# Altium project test1.PrjPcb
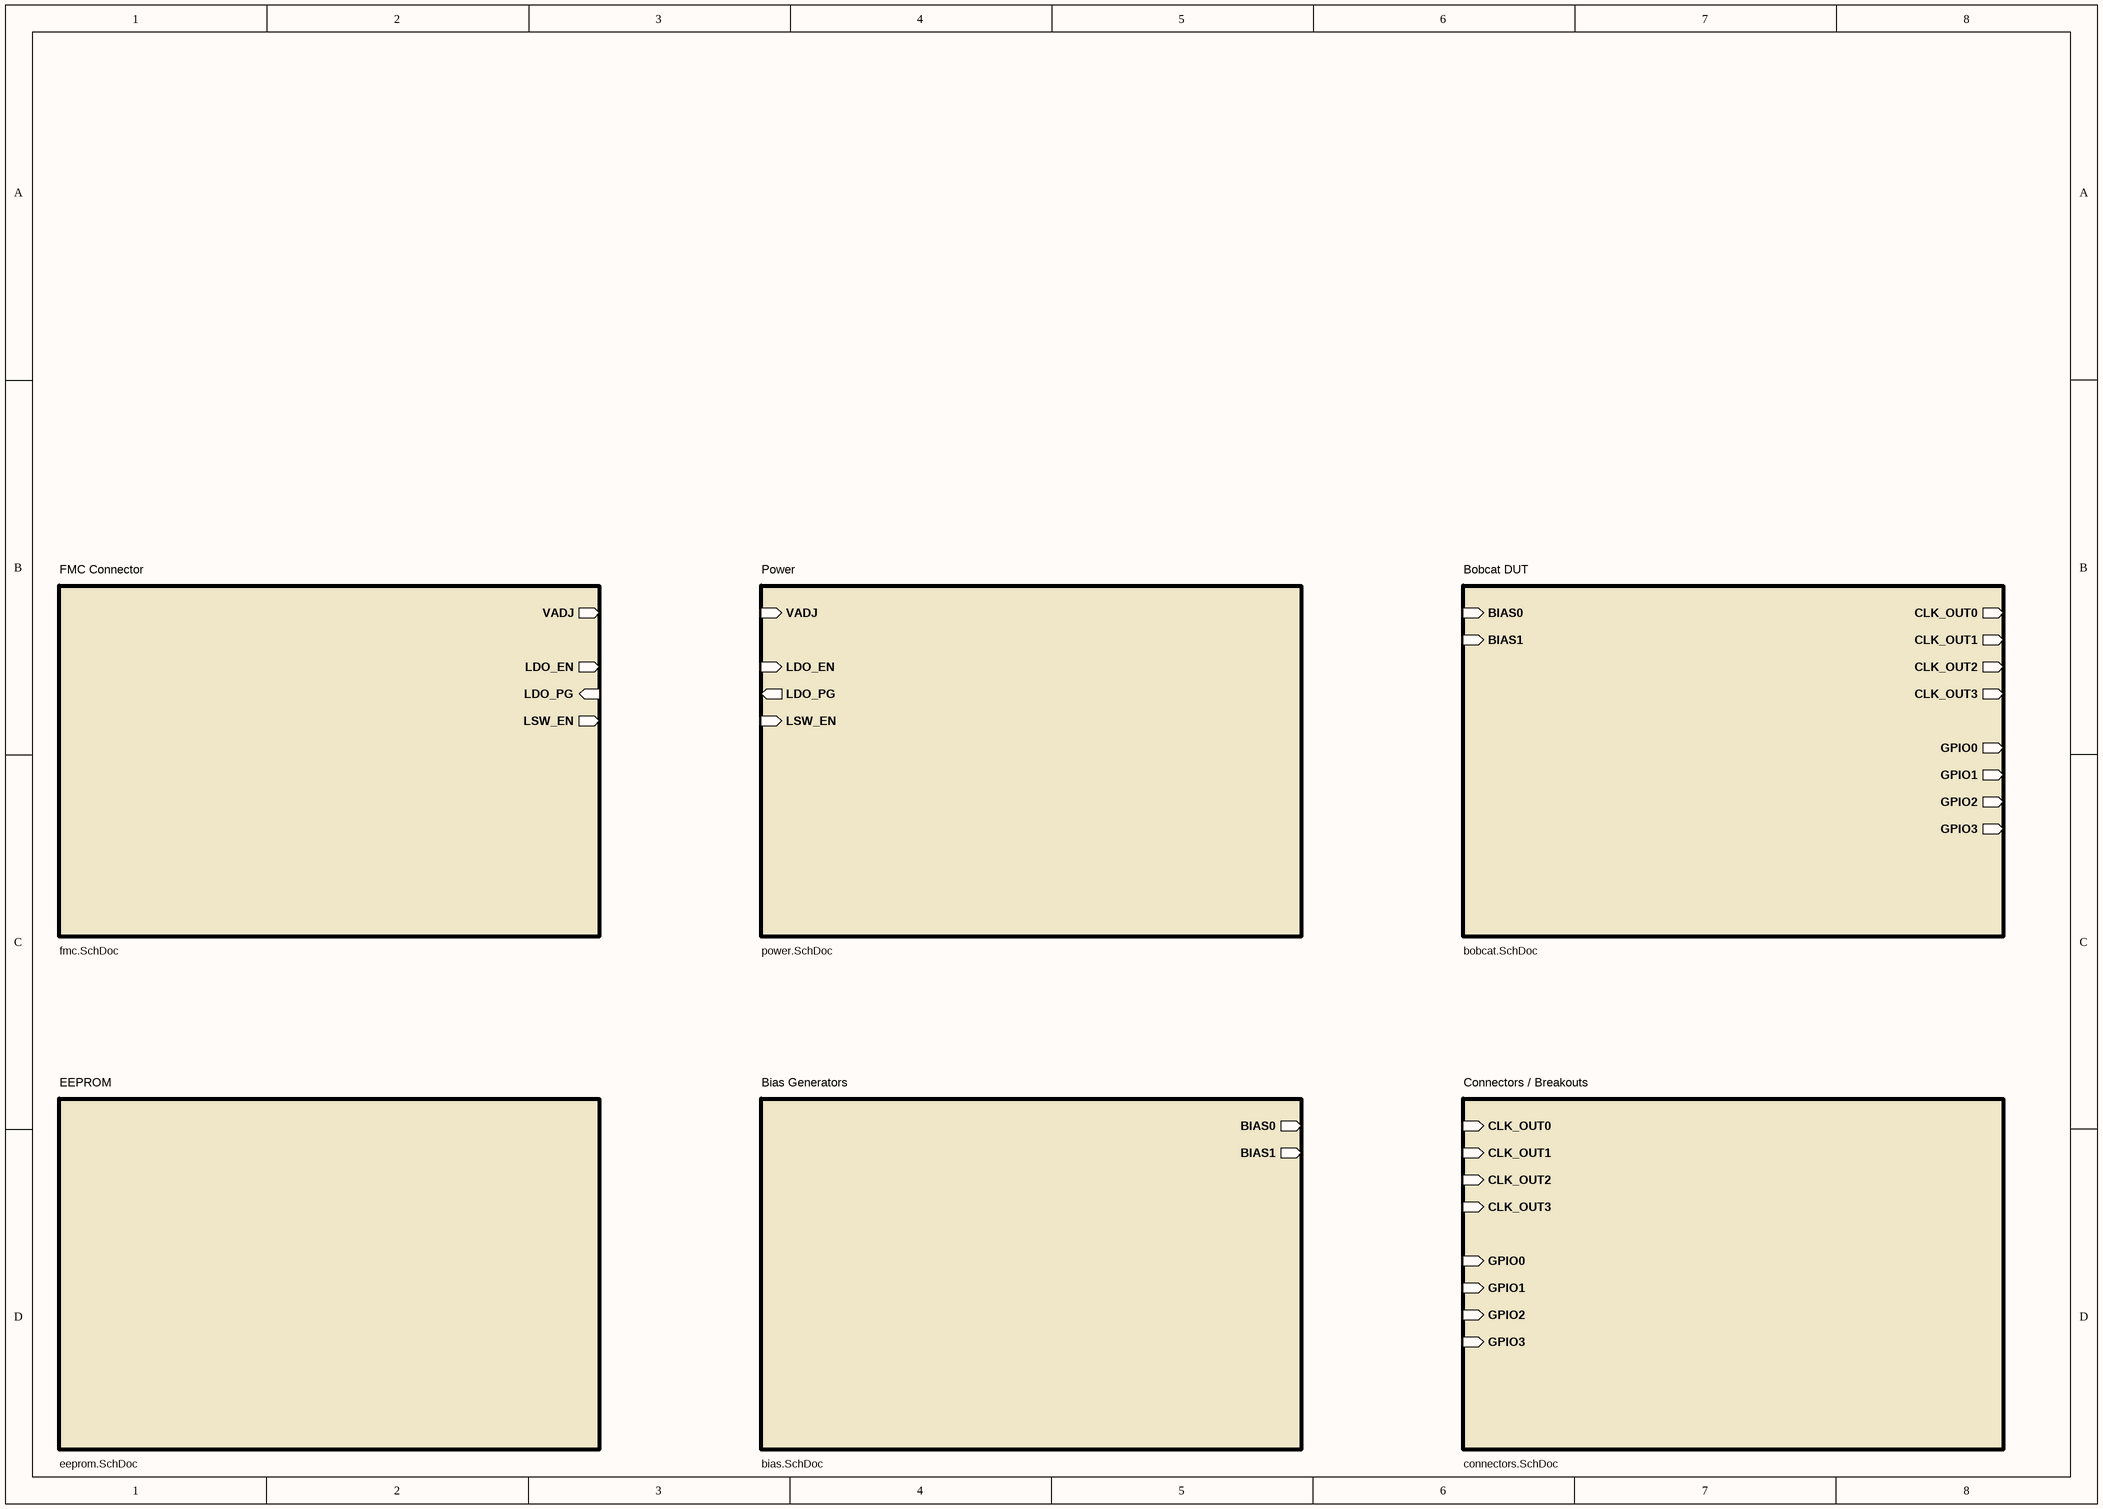
[diagram p0: root.SchDoc]
7 sheets, 107 parts. Net scope: hierarchical (ports join the sheet entries above them; power ports are global).
Sheets:
  root.SchDoc
    FMC Connector = fmc.SchDoc
    Power = power.SchDoc
    Bobcat DUT = bobcat.SchDoc
    EEPROM = eeprom.SchDoc
    Bias Generators = bias.SchDoc
    Connectors / Breakouts = connectors.SchDoc

## Sheet root.SchDoc
size A3

### Sub-sheets
Bias Generators = bias.SchDoc: BIAS0 (out), BIAS1 (out)
Bobcat DUT = bobcat.SchDoc: BIAS0 (in), BIAS1 (in), CLK_OUT0 (out), CLK_OUT1 (out), CLK_OUT2 (out), CLK_OUT3 (out), GPIO0 (out), GPIO1 (out), GPIO2 (out), GPIO3 (out)
Connectors / Breakouts = connectors.SchDoc: CLK_OUT0 (in), CLK_OUT1 (in), CLK_OUT2 (in), CLK_OUT3 (in), GPIO0 (in), GPIO1 (in), GPIO2 (in), GPIO3 (in)
EEPROM = eeprom.SchDoc: no entries
FMC Connector = fmc.SchDoc: VADJ (out), LDO_EN (out), LDO_PG (in), LSW_EN (out)
Power = power.SchDoc: VADJ (in), LDO_EN (in), LDO_PG (out), LSW_EN (in)

## Sheet fmc.SchDoc
size A3
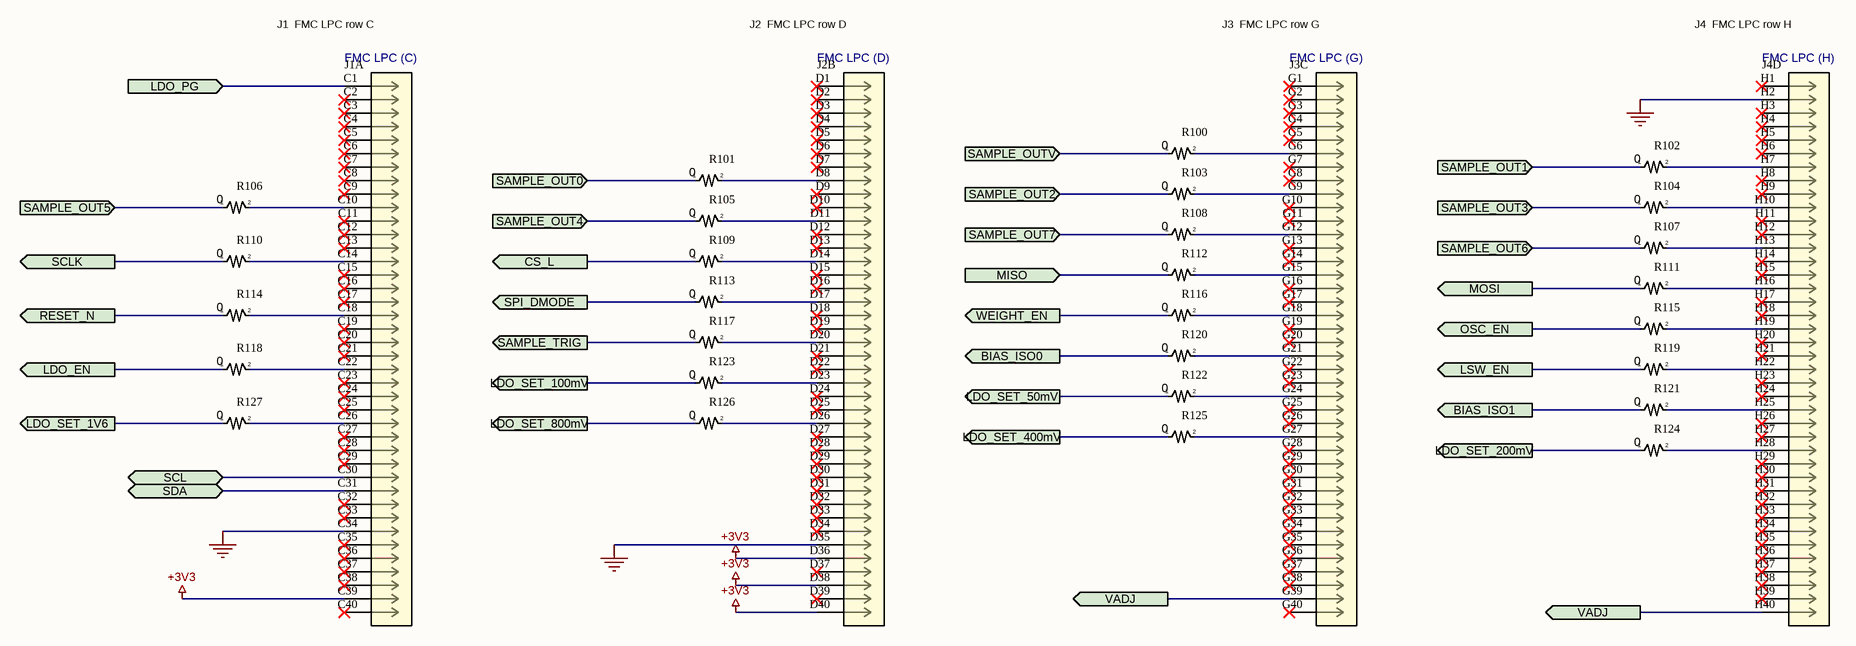
[diagram p1: fmc.SchDoc]

### Parts
J1  FMC LPC (C)  (part A of 3)
J2  FMC LPC (D)  (part B of 3)
J3  FMC LPC (G)  (part C of 3)
J4  FMC LPC (H)  (part D of 3)
R100  0
R101  0
R102  0
R103  0
R104  0
R105  0
R106  0
R107  0
R108  0
R109  0
R110  0
R111  0
R112  0
R113  0
R114  0
R115  0
R116  0
R117  0
R118  0
R119  0
R120  0
R121  0
R122  0
R123  0
R124  0
R125  0
R126  0
R127  0

### Ports
BIAS_ISO0 (out), BIAS_ISO1 (out), CS_L (out), LDO_EN (out), LDO_PG (in), LDO_SET_1V6 (out), LDO_SET_50mV (out), LDO_SET_100mV (out), LDO_SET_200mV (out), LDO_SET_400mV (out), LDO_SET_800mV (out), LSW_EN (out), MISO (in), MOSI (out), OSC_EN (out), RESET_N (out), SAMPLE_OUT0 (in), SAMPLE_OUT1 (in), SAMPLE_OUT2 (in), SAMPLE_OUT3 (in), SAMPLE_OUT4 (in), SAMPLE_OUT5 (in), SAMPLE_OUT6 (in), SAMPLE_OUT7 (in), SAMPLE_OUTV (in), SAMPLE_TRIG (out), SCL (bidir), SCLK (out), SDA (bidir), SPI_DMODE (out), VADJ (out), WEIGHT_EN (out)

### Nets
+3V3: J1.C39 J2.D36 J2.D38 J2.D40
GND: J1.C34 J2.D35 J4.H2
NetJ1_C1: J1.C1 ; port LDO_PG
NetJ1_C10: J1.C10 R106.2
NetJ1_C14: J1.C14 R110.2
NetJ1_C18: J1.C18 R114.2
NetJ1_C22: J1.C22 R118.2
NetJ1_C26: J1.C26 R127.2
NetJ1_C30: J1.C30 ; port SCL
NetJ1_C31: J1.C31 ; port SDA
NetJ2_D8: J2.D8 R101.2
NetJ2_D11: J2.D11 R105.2
NetJ2_D14: J2.D14 R109.2
NetJ2_D17: J2.D17 R113.2
NetJ2_D20: J2.D20 R117.2
NetJ2_D23: J2.D23 R123.2
NetJ2_D26: J2.D26 R126.2
NetJ3_G6: J3.G6 R100.2
NetJ3_G9: J3.G9 R103.2
NetJ3_G12: J3.G12 R108.2
NetJ3_G15: J3.G15 R112.2
NetJ3_G18: J3.G18 R116.2
NetJ3_G21: J3.G21 R120.2
NetJ3_G24: J3.G24 R122.2
NetJ3_G27: J3.G27 R125.2
NetJ3_G39: J3.G39 J4.H40 ; port VADJ
NetJ4_H7: J4.H7 R102.2
NetJ4_H10: J4.H10 R104.2
NetJ4_H13: J4.H13 R107.2
NetJ4_H16: J4.H16 R111.2
NetJ4_H19: J4.H19 R115.2
NetJ4_H22: J4.H22 R119.2
NetJ4_H25: J4.H25 R121.2
NetJ4_H28: J4.H28 R124.2
NetR100_1: R100.1 ; port SAMPLE_OUTV
NetR101_1: R101.1 ; port SAMPLE_OUT0
NetR102_1: R102.1 ; port SAMPLE_OUT1
NetR103_1: R103.1 ; port SAMPLE_OUT2
NetR104_1: R104.1 ; port SAMPLE_OUT3
NetR105_1: R105.1 ; port SAMPLE_OUT4
NetR106_1: R106.1 ; port SAMPLE_OUT5
NetR107_1: R107.1 ; port SAMPLE_OUT6
NetR108_1: R108.1 ; port SAMPLE_OUT7
NetR109_1: R109.1 ; port CS_L
NetR110_1: R110.1 ; port SCLK
NetR111_1: R111.1 ; port MOSI
NetR112_1: R112.1 ; port MISO
NetR113_1: R113.1 ; port SPI_DMODE
NetR114_1: R114.1 ; port RESET_N
NetR115_1: R115.1 ; port OSC_EN
NetR116_1: R116.1 ; port WEIGHT_EN
NetR117_1: R117.1 ; port SAMPLE_TRIG
NetR118_1: R118.1 ; port LDO_EN
NetR119_1: R119.1 ; port LSW_EN
NetR120_1: R120.1 ; port BIAS_ISO0
NetR121_1: R121.1 ; port BIAS_ISO1
NetR122_1: R122.1 ; port LDO_SET_50mV
NetR123_1: R123.1 ; port LDO_SET_100mV
NetR124_1: R124.1 ; port LDO_SET_200mV
NetR125_1: R125.1 ; port LDO_SET_400mV
NetR126_1: R126.1 ; port LDO_SET_800mV
NetR127_1: R127.1 ; port LDO_SET_1V6

Not connected (* = marked no-connect by the designer): J1 C2* C3* C4* C5* C6* C7* C8* C9* C11* C12* C13* C15* C16* C17* C19* C20* C21* C23* C24* C25* C27* C28* C29* C32* C33* C35* C36* C37* C38* C40*; J2 D1* D2* D3* D4* D5* D6* D7* D9* D10* D12* D13* D15* D16* D18* D19* D21* D22* D24* D25* D27* D28* D29* D30* D31* D32* D33* D34* D37* D39*; J3 G1* G2* G3* G4* G5* G7* G8* G10* G11* G13* G14* G16* G17* G19* G20* G22* G23* G25* G26* G28* G29* G30* G31* G32* G33* G34* G35* G36* G37* G38* G40*; J4 H1* H3* H4* H5* H6* H8* H9* H11* H12* H14* H15* H17* H18* H20* H21* H23* H24* H26* H27* H29* H30* H31* H32* H33* H34* H35* H36* H37* H38* H39*

### Notes on the sheet
- J1  FMC LPC row C
- J2  FMC LPC row D
- J3  FMC LPC row G
- J4  FMC LPC row H

### Library data of the parts
J1-J4 = ASP-134606-01: Description; Manufacturer_Name: Samtec Inc; Type: Arrays, Edge Type, Mezzanine (Board to Board); Copyright: Copyright (C) 2025 Ultra Librarian. All rights reserved.; Manufacturer_Part_Number: ASP-134606-01; RefDes: RefDes
R100-R127 = CRCW04020000Z0ED: D10/CRCW0402 0R0 ET7 e3; Manufacturer_Name: Vishay; Manufacturer_Part_Number: CRCW04020000Z0ED

## Sheet power.SchDoc
size A3
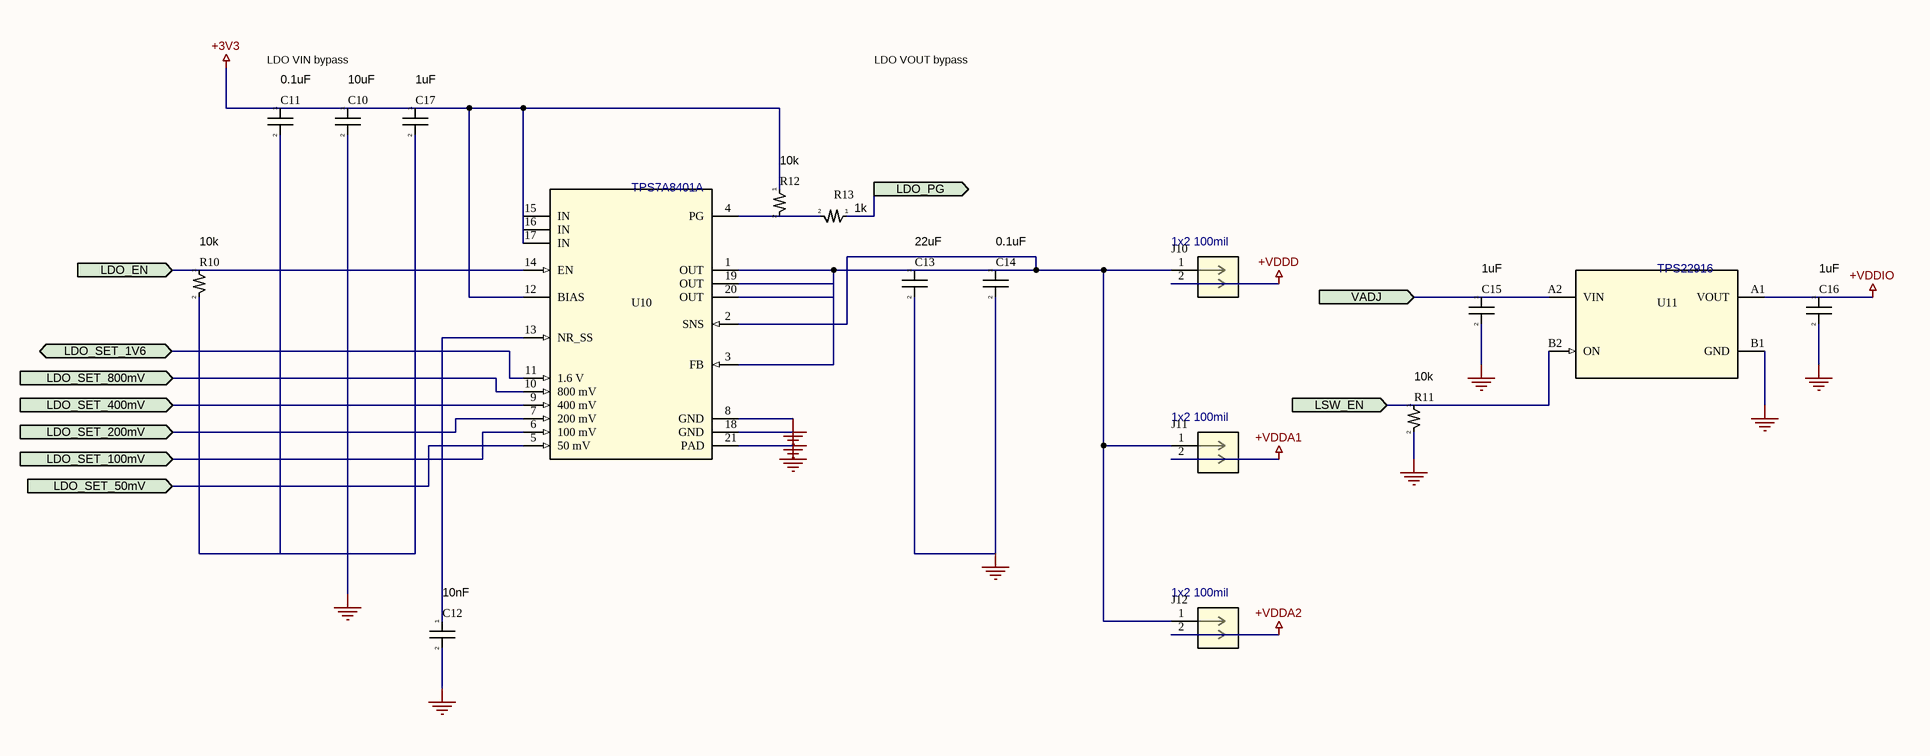
[diagram p2: power.SchDoc]

### Parts
C10  10uF
C11  0.1uF
C12  10nF
C13  22uF
C14  0.1uF
C15  1uF
C16  1uF
C17  1uF
J10  1x2 100mil
J11  1x2 100mil
J12  1x2 100mil
R10  10k
R11  10k
R12  10k
R13  1k
U10  TPS7A8401A
U11  TPS22916

### Ports
LDO_EN (in), LDO_PG (out), LDO_SET_1V6 (in), LDO_SET_50mV (in), LDO_SET_100mV (in), LDO_SET_200mV (in), LDO_SET_400mV (in), LDO_SET_800mV (in), LSW_EN (in), VADJ (in)

### Nets
+3V3: C10.1 C11.1 C17.1 R12.1 U10.12(BIAS) U10.15(IN) U10.16(IN) U10.17(IN)
+VDDA1: J11.2
+VDDA2: J12.2
+VDDD: J10.2
+VDDIO: C16.1 U11.A1(VOUT)
GND: C10.2 C11.2 C12.2 C13.2 C14.2 C15.2 C16.2 C17.2 R10.2 R11.2 U10.8(GND) U10.18(GND) U10.21(PAD) U11.B1(GND)
NetC12_1: C12.1 U10.13(NR_SS)
NetC13_1: C13.1 C14.1 J10.1 J11.1 J12.1 U10.1(OUT) U10.2(SNS) U10.3(FB) U10.19(OUT) U10.20(OUT)
NetC15_1: C15.1 U11.A2(VIN) ; port VADJ
NetR10_1: R10.1 U10.14(EN) ; port LDO_EN
NetR11_1: R11.1 U11.B2(ON) ; port LSW_EN
NetR12_2: R12.2 R13.2 U10.4(PG)
NetR13_1: R13.1 ; port LDO_PG
NetU10_5: U10.5(50_mV) ; port LDO_SET_50mV
NetU10_6: U10.6(100_mV) ; port LDO_SET_100mV
NetU10_7: U10.7(200_mV) ; port LDO_SET_200mV
NetU10_9: U10.9(400_mV) ; port LDO_SET_400mV
NetU10_10: U10.10(800_mV) ; port LDO_SET_800mV
NetU10_11: U10.11(1.6_V) ; port LDO_SET_1V6

### Notes on the sheet
- LDO VIN bypass
- LDO VOUT bypass

### Library data of the parts
C10 = GRM21BR71A106KA73L: Manufacturer_Name: Murata; Manufacturer_Part_Number: GRM21BR71A106KA73L
C11 C14 = GRM155R71C104KA88D: CAP CER 0.1UF 16V X7R 0402; Manufacturer_Name: Murata; Manufacturer_Part_Number: GRM155R71C104KA88D
C12 = GRM155R71H103KA88D: Manufacturer_Name: Murata; Manufacturer_Part_Number: GRM155R71H103KA88D
C13 = GRM21BR61A226ME44L: Manufacturer_Name: Murata; Manufacturer_Part_Number: GRM21BR61A226ME44L
C15-C17 = GRM155R70J105KA12D: Manufacturer_Name: Murata; Manufacturer_Part_Number: GRM155R70J105KA12D
J10-J12 = TSW-102-05-G-S: No Description Available; Manufacturer_Name: Samtec Inc; Copyright: Copyright (C) 2026 Ultra Librarian. All rights reserved.; Manufacturer_Part_Number: TSW-102-05-G-S; RefDes: RefDes; Type: Type
R10-R12 = CR0402-FX-1002GLF: Manufacturer_Name: Bourns Electronics; Manufacturer_Part_Number: CR0402-FX-1002GLF
R13 = CR0402-FX-1001GLF: Manufacturer_Name: Bourns Electronics; Manufacturer_Part_Number: CR0402-FX-1001GLF
U10 = TPS7A8401ARGRR: 3-A, low-VIN (1.1-V), low-noise, high-accuracy, ultra-low-dropout voltage regulator with power good 20-VQFN -40 to 125; Manufacturer_Name: Texas Instruments; TYPE: TYPE; RefDes: RefDes; Copyright: Copyright (C) 2025 Ultra Librarian. All rights reserved.; Manufacturer_Part_Number: TPS7A8401ARGRR
U11 = TPS22916CNYFPR: 5.5-V, 2-A, 60-mΩ, 10-nA leakage load switch with output discharge 4-DSBGA -40 to 85; Manufacturer_Name: Texas Instruments; Description: 5.5-V, 2-A, 60-mÎ©, 10-nA leakage load switch with output discharge 4-DSBGA -40 to 85; TYPE: TYPE; RefDes: RefDes; Copyright: Copyright (C) 2026 Ultra Librarian. All rights reserved.; Manufacturer_Part_Number: TPS22916CNYFPR

## Sheet bobcat.SchDoc
size A2
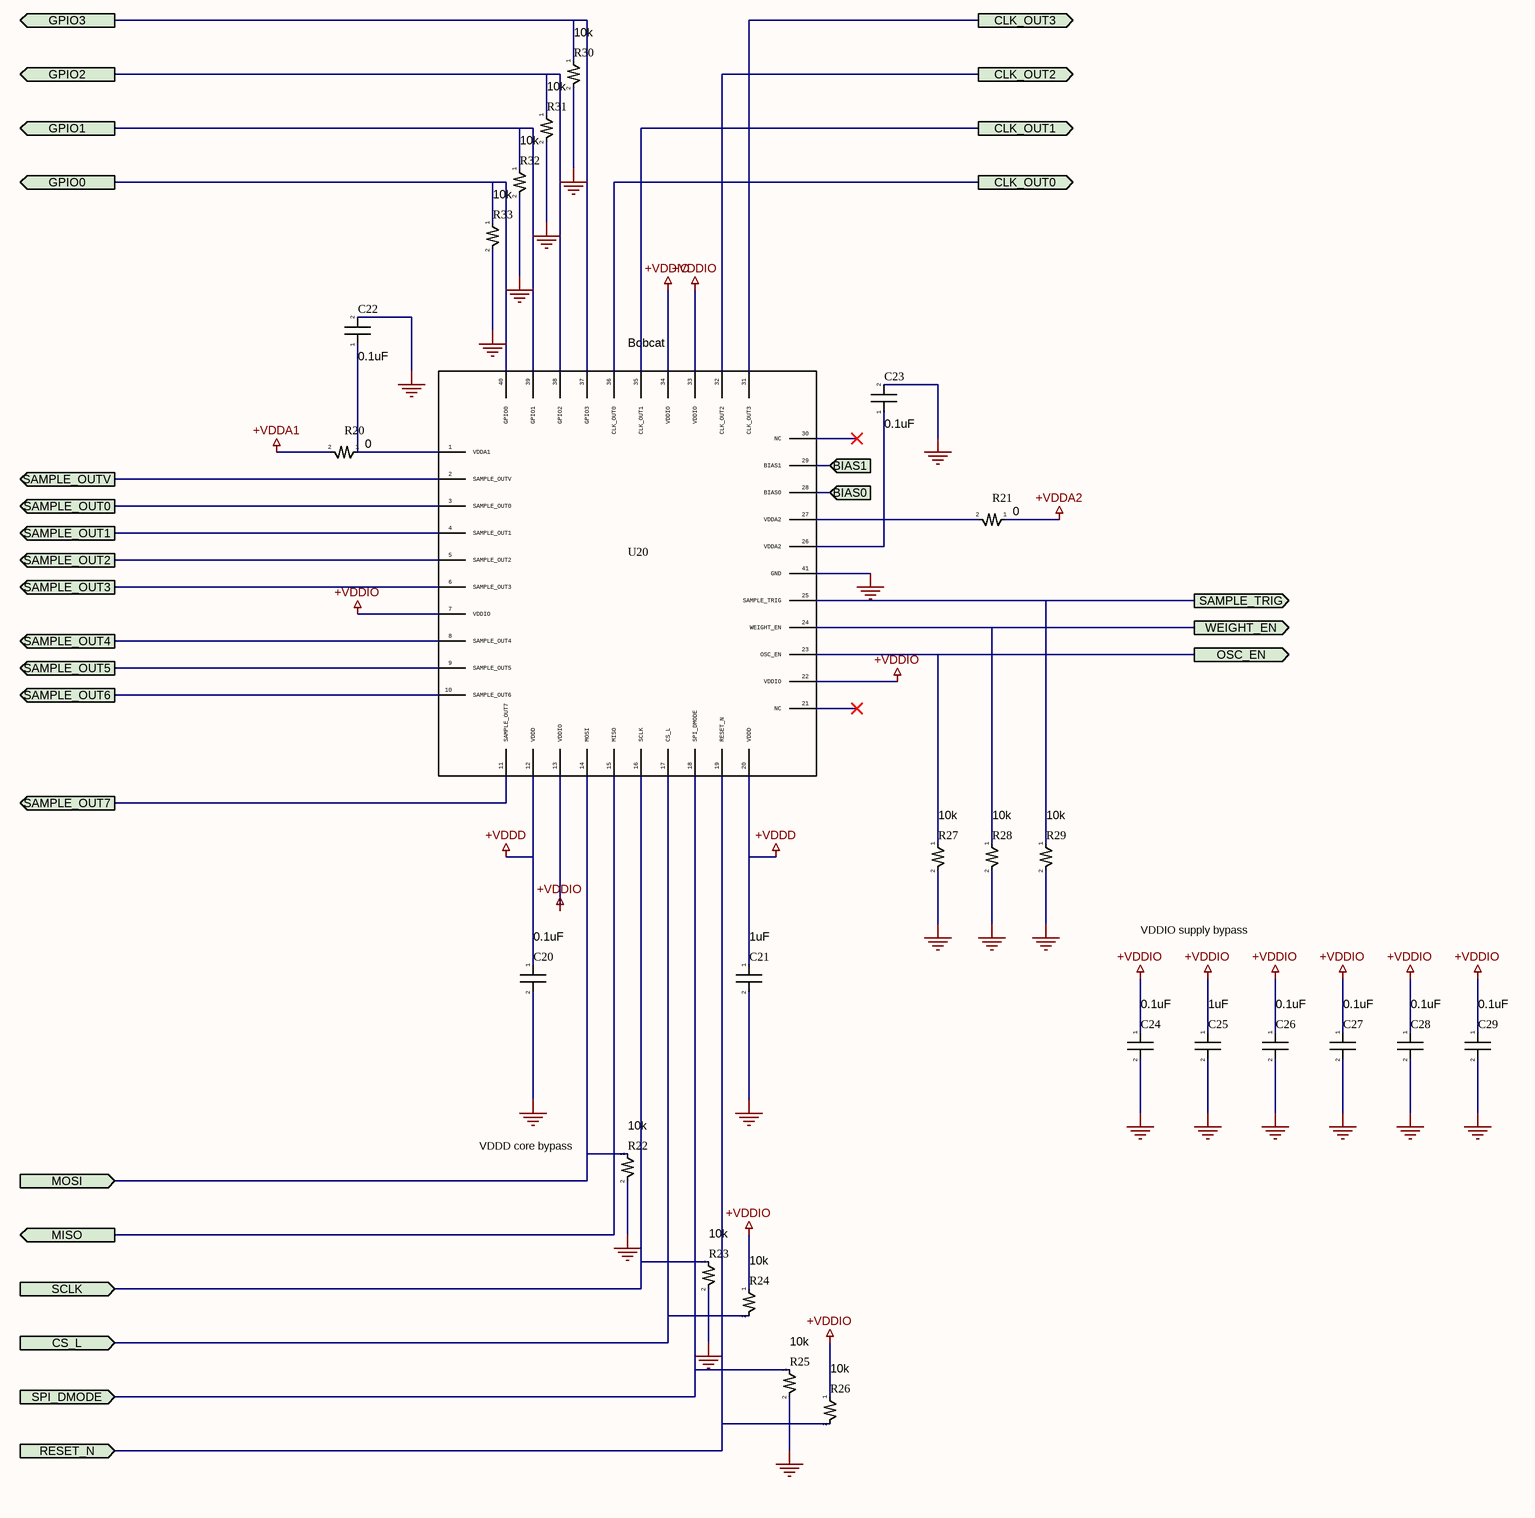
[diagram p3: bobcat.SchDoc]

### Parts
C20  0.1uF
C21  1uF
C22  0.1uF
C23  0.1uF
C24  0.1uF
C25  1uF
C26  0.1uF
C27  0.1uF
C28  0.1uF
C29  0.1uF
R20  0
R21  0
R22  10k
R23  10k
R24  10k
R25  10k
R26  10k
R27  10k
R28  10k
R29  10k
R30  10k
R31  10k
R32  10k
R33  10k
U20  Bobcat

### Ports
BIAS0 (in), BIAS1 (in), CLK_OUT0 (out), CLK_OUT1 (out), CLK_OUT2 (out), CLK_OUT3 (out), CS_L (in), GPIO0 (out), GPIO1 (out), GPIO2 (out), GPIO3 (out), MISO (out), MOSI (in), OSC_EN (out), RESET_N (in), SAMPLE_OUT0 (out), SAMPLE_OUT1 (out), SAMPLE_OUT2 (out), SAMPLE_OUT3 (out), SAMPLE_OUT4 (out), SAMPLE_OUT5 (out), SAMPLE_OUT6 (out), SAMPLE_OUT7 (out), SAMPLE_OUTV (out), SAMPLE_TRIG (out), SCLK (in), SPI_DMODE (in), WEIGHT_EN (out)

### Nets
+VDDA1: R20.2
+VDDA2: R21.1
+VDDD: C20.1 C21.1 U20.12(VDDD) U20.20(VDDD)
+VDDIO: C24.1 C25.1 C26.1 C27.1 C28.1 C29.1 R24.1 R26.1 U20.7(VDDIO) U20.13(VDDIO) U20.22(VDDIO) U20.33(VDDIO) U20.34(VDDIO)
GND: C20.2 C21.2 C22.2 C23.2 C24.2 C25.2 C26.2 C27.2 C28.2 C29.2 R22.2 R23.2 R25.2 R27.2 R28.2 R29.2 R30.2 R31.2 R32.2 R33.2 U20.41(GND)
NetC22_1: C22.1 R20.1 U20.1(VDDA1)
NetC23_1: C23.1 R21.2 U20.26(VDDA2) U20.27(VDDA2)
NetR22_1: R22.1 U20.14(MOSI) ; port MOSI
NetR23_1: R23.1 U20.16(SCLK) ; port SCLK
NetR24_2: R24.2 U20.17(CS_L) ; port CS_L
NetR25_1: R25.1 U20.18(SPI_DMODE) ; port SPI_DMODE
NetR26_2: R26.2 U20.19(RESET_N) ; port RESET_N
NetR27_1: R27.1 U20.23(OSC_EN) ; port OSC_EN
NetR28_1: R28.1 U20.24(WEIGHT_EN) ; port WEIGHT_EN
NetR29_1: R29.1 U20.25(SAMPLE_TRIG) ; port SAMPLE_TRIG
NetR30_1: R30.1 U20.37(GPIO3) ; port GPIO3
NetR31_1: R31.1 U20.38(GPIO2) ; port GPIO2
NetR32_1: R32.1 U20.39(GPIO1) ; port GPIO1
NetR33_1: R33.1 U20.40(GPIO0) ; port GPIO0
NetU20_2: U20.2(SAMPLE_OUTV) ; port SAMPLE_OUTV
NetU20_3: U20.3(SAMPLE_OUT0) ; port SAMPLE_OUT0
NetU20_4: U20.4(SAMPLE_OUT1) ; port SAMPLE_OUT1
NetU20_5: U20.5(SAMPLE_OUT2) ; port SAMPLE_OUT2
NetU20_6: U20.6(SAMPLE_OUT3) ; port SAMPLE_OUT3
NetU20_8: U20.8(SAMPLE_OUT4) ; port SAMPLE_OUT4
NetU20_9: U20.9(SAMPLE_OUT5) ; port SAMPLE_OUT5
NetU20_10: U20.10(SAMPLE_OUT6) ; port SAMPLE_OUT6
NetU20_11: U20.11(SAMPLE_OUT7) ; port SAMPLE_OUT7
NetU20_15: U20.15(MISO) ; port MISO
NetU20_28: U20.28(BIAS0) ; port BIAS0
NetU20_29: U20.29(BIAS1) ; port BIAS1
NetU20_31: U20.31(CLK_OUT3) ; port CLK_OUT3
NetU20_32: U20.32(CLK_OUT2) ; port CLK_OUT2
NetU20_35: U20.35(CLK_OUT1) ; port CLK_OUT1
NetU20_36: U20.36(CLK_OUT0) ; port CLK_OUT0

Not connected (* = marked no-connect by the designer): U20 21(NC)* 30(NC)*

### Notes on the sheet
- VDDIO supply bypass
- VDDD core bypass

### Library data of the parts
C20 C22-C24 C26-C29 = GRM155R71C104KA88D: as C11 on sheet power; Manufacturer_Part_Number: GRM155R71C104KA88D
C21 C25 = GRM155R70J105KA12D: Manufacturer_Name: Murata; Manufacturer_Part_Number: GRM155R70J105KA12D
R20 R21 = CRCW04020000Z0ED: as R100 on sheet fmc; Manufacturer_Part_Number: CRCW04020000Z0ED
R22-R33 = CR0402-FX-1002GLF: Manufacturer_Name: Bourns Electronics; Manufacturer_Part_Number: CR0402-FX-1002GLF
U20 = Bobcat: Bobcat mixed-signal test chip — 40-QFN, 5x5 mm, 0.4 mm pitch, exposed GND pad (41); Manufacturer: Unconventional AI; Value: Bobcat; Footprint: Bobcat:QFN-40_5x5mm_P0.4mm_EP3.5mm; MPN: Bobcat

## Sheet eeprom.SchDoc
size A4
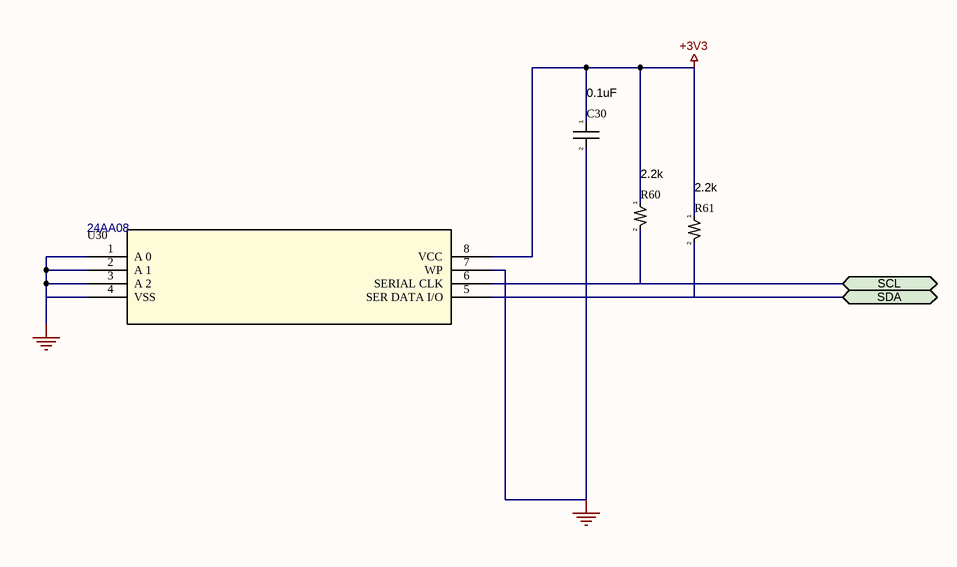
[diagram p4: eeprom.SchDoc]

### Parts
C30  0.1uF
R60  2.2k
R61  2.2k
U30  24AA08

### Ports
SCL (bidir), SDA (bidir)

### Nets
+3V3: C30.1 R60.1 R61.1 U30.8(VCC)
GND: C30.2 U30.1(A_0) U30.2(A_1) U30.3(A_2) U30.4(VSS) U30.7(WP)
NetR60_2: R60.2 U30.6(SERIAL_CLK) ; port SCL
NetR61_2: R61.2 U30.5(SER_DATA_I/O) ; port SDA

### Library data of the parts
C30 = GRM155R71C104KA88D: as C11 on sheet power; Manufacturer_Part_Number: GRM155R71C104KA88D
R60 R61 = CR0402-FX-2201GLF: Manufacturer_Name: Bourns Electronics; Manufacturer_Part_Number: CR0402-FX-2201GLF
U30 = 24AA08-ISN: No Description Available; Manufacturer_Name: Microchip; Manufacturer_Part_Number: 24AA08-I/SN; Copyright: Copyright (C) 2026 Ultra Librarian. All rights reserved.; RefDes: RefDes; Type: Type

## Sheet bias.SchDoc
size A2
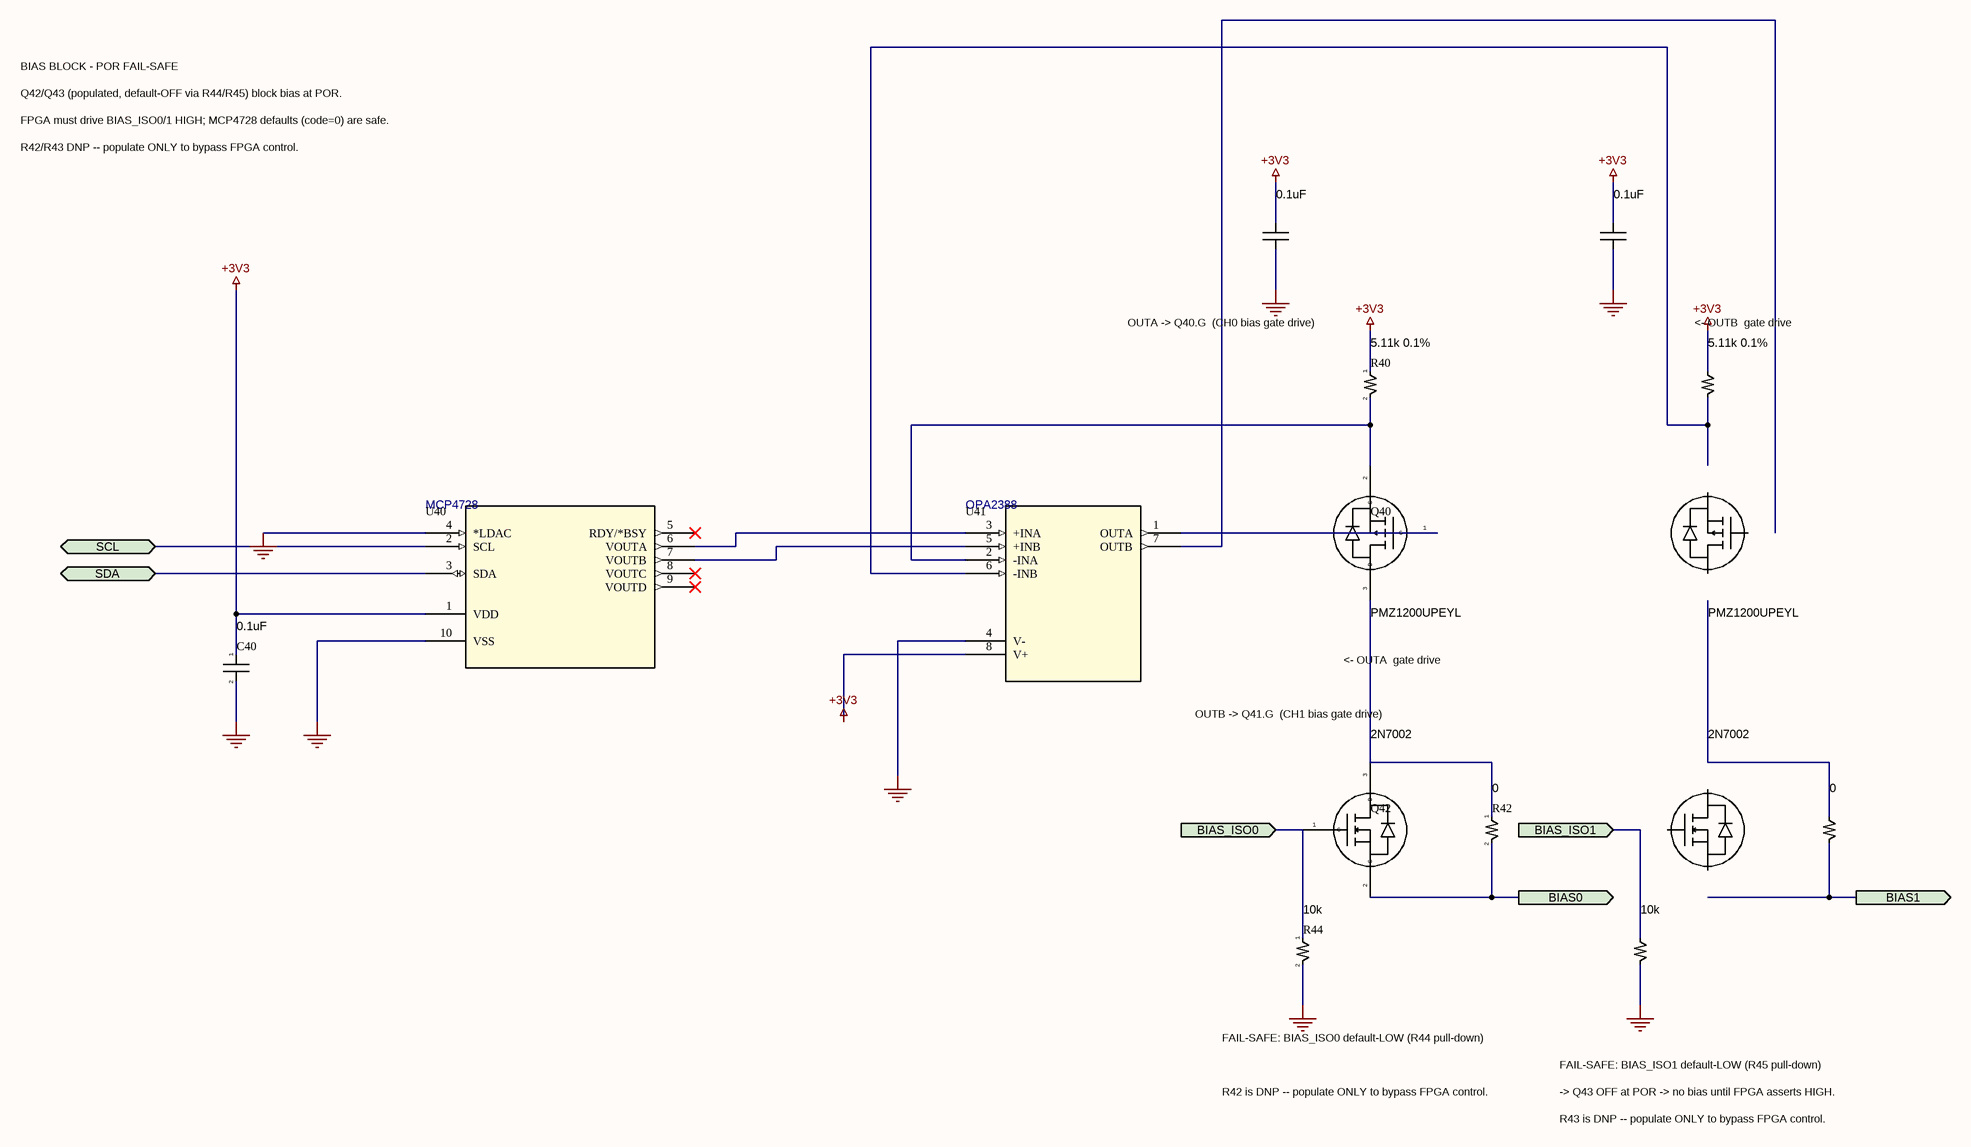
[diagram p5: bias.SchDoc]

### Parts
(Parts that share a designator on the sheet are numbered #1, #2 ... from top to bottom, then left to right.)
?#1  (no value)
?#2  (no value)
?#3  (no value)
?#4  (no value)
?#5  (no value)
?#6  (no value)
?#7  (no value)
C40  0.1uF
Q40  PMZ1200UPEYL
Q42  2N7002
R40  5.11k 0.1%
R42  0
R44  10k
U40  MCP4728
U41  OPA2388

### Ports
BIAS0 (out), BIAS1 (out), BIAS_ISO0 (in), BIAS_ISO1 (in), SCL (bidir), SDA (bidir)

### Nets
+3V3: C40.1 R40.1 U40.1(VDD) U41.8(V+)
GND: C40.2 R44.2 U40.4(*LDAC) U40.10(VSS) U41.4(V-)
NetQ40_1: Q40.1(G) U41.1(OUTA)
NetQ40_2: Q40.2(S) R40.2 U41.2(-INA)
NetQ40_3: Q40.3(D) Q42.3(D) R42.1
NetQ42_1: Q42.1(G) R44.1 ; port BIAS_ISO0
NetQ42_2: Q42.2(S) R42.2 ; port BIAS0
NetU40_2: U40.2(SCL) ; port SCL
NetU40_3: U40.3(SDA) ; port SDA
NetU40_6: U40.6(VOUTA) U41.3(+INA)
NetU40_7: U40.7(VOUTB) U41.5(+INB)

Not connected (* = marked no-connect by the designer): U40 5(RDY/*BSY)* 8(VOUTC)* 9(VOUTD)*; U41 6(-INB) 7(OUTB)

### Notes on the sheet
- BIAS BLOCK - POR FAIL-SAFE
- Q42/Q43 (populated, default-OFF via R44/R45) block bias at POR.
- FPGA must drive BIAS_ISO0/1 HIGH; MCP4728 defaults (code=0) are safe.
- R42/R43 DNP -- populate ONLY to bypass FPGA control.
- OUTA -> Q40.G  (CH0 bias gate drive)
- <- OUTB  gate drive
- OUTB -> Q41.G  (CH1 bias gate drive)
- <- OUTA  gate drive
- FAIL-SAFE: BIAS_ISO0 default-LOW (R44 pull-down)
- R42 is DNP -- populate ONLY to bypass FPGA control.
- FAIL-SAFE: BIAS_ISO1 default-LOW (R45 pull-down)
- -> Q43 OFF at POR -> no bias until FPGA asserts HIGH.
- R43 is DNP -- populate ONLY to bypass FPGA control.

### Library data of the parts
?#1 ?#2 = GRM155R71C104KA88D: CAP CER 0.1UF 16V X7R 0402
?#3 = TNPW06035K11BEEA: TNPW0603 5K11 0.1% T-9 ET1 e3
?#4 = PMZ1200UPEYL: 30 V P-channel Trench MOSFET, DFN1006-3 (SOT883)
?#5 Q42 = 2N7002: N-channel enhancement MOSFET (body diode)
  Q42: Footprint: SOT-23TO-236_318-08_ONS; Datasheet: 2N7002
?#6 = CRCW04020000Z0ED: D10/CRCW0402 0R0 ET7 e3
?#7 = CR0402-FX-1002GLF
C40 = GRM155R71C104KA88D: as C11 on sheet power; Manufacturer_Part_Number: GRM155R71C104KA88D
Q40 = PMZ1200UPEYL: 30 V P-channel Trench MOSFET, DFN1006-3 (SOT883); Manufacturer: Nexperia; Footprint: PMZ1200UPEYL:DFN1006-3_SOT883; Datasheet: https://assets.nexperia.com/documents/data-sheet/PMZ1200UPE.pdf; MPN: PMZ1200UPEYL
R40 = TNPW06035K11BEEA: TNPW0603 5K11 0.1% T-9 ET1 e3; Manufacturer_Name: Vishay; Manufacturer_Part_Number: TNPW06035K11BEEA; Datasheet: https://www.vishay.com/doc?28758
R42 = CRCW04020000Z0ED: as R100 on sheet fmc; Manufacturer_Part_Number: CRCW04020000Z0ED
R44 = CR0402-FX-1002GLF: Manufacturer_Name: Bourns Electronics; Manufacturer_Part_Number: CR0402-FX-1002GLF
U40 = MCP4728T-EUN: Description; Manufacturer_Name: Microchip; Manufacturer_Part_Number: MCP4728T-E/UN; Copyright: Copyright (C) 2026 Ultra Librarian. All rights reserved.; RefDes: RefDes; Type: Type
U41 = OPA2388IDGKR: Dual, 10-MHz, CMOS, zero-drift, zero-crossover, true RRIO precision operational amplifier 8-VSSOP -40 to 125; Manufacturer_Name: Texas Instruments; Copyright: Copyright (C) 2026 Ultra Librarian. All rights reserved.; Manufacturer_Part_Number: OPA2388IDGKR; RefDes: RefDes; Type: Type

## Sheet connectors.SchDoc
size A2
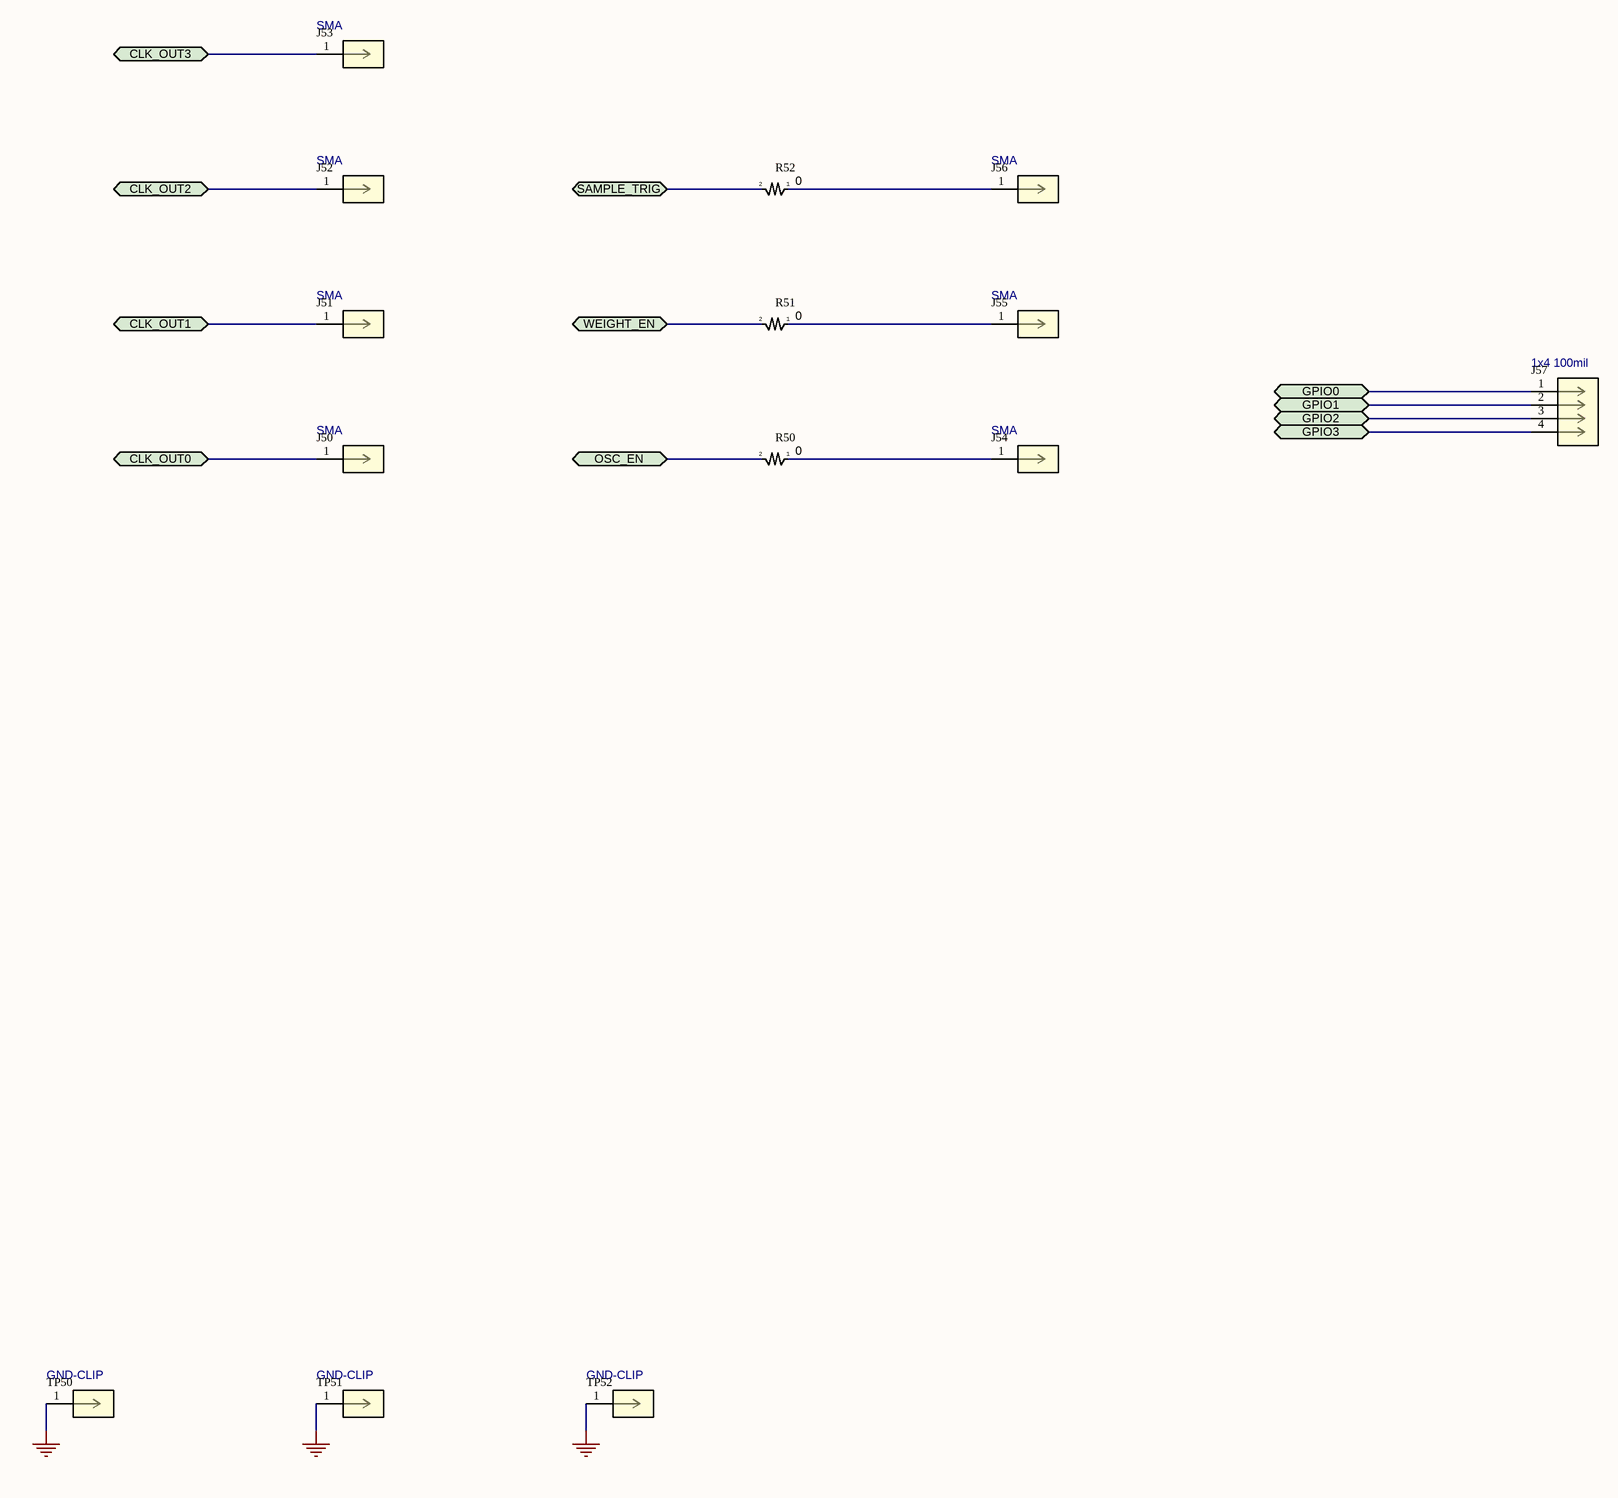
[diagram p6: connectors.SchDoc]

### Parts
J50  SMA
J51  SMA
J52  SMA
J53  SMA
J54  SMA
J55  SMA
J56  SMA
J57  1x4 100mil
R50  0
R51  0
R52  0
TP50  GND-CLIP
TP51  GND-CLIP
TP52  GND-CLIP

### Ports
CLK_OUT0 (bidir), CLK_OUT1 (bidir), CLK_OUT2 (bidir), CLK_OUT3 (bidir), GPIO0 (bidir), GPIO1 (bidir), GPIO2 (bidir), GPIO3 (bidir), OSC_EN (bidir), SAMPLE_TRIG (bidir), WEIGHT_EN (bidir)

### Nets
GND: TP50.1 TP51.1 TP52.1
NetJ50_1: J50.1 ; port CLK_OUT0
NetJ51_1: J51.1 ; port CLK_OUT1
NetJ52_1: J52.1 ; port CLK_OUT2
NetJ53_1: J53.1 ; port CLK_OUT3
NetJ54_1: J54.1 R50.1
NetJ55_1: J55.1 R51.1
NetJ56_1: J56.1 R52.1
NetJ57_1: J57.1 ; port GPIO0
NetJ57_2: J57.2 ; port GPIO1
NetJ57_3: J57.3 ; port GPIO2
NetJ57_4: J57.4 ; port GPIO3
NetR50_2: R50.2 ; port OSC_EN
NetR51_2: R51.2 ; port WEIGHT_EN
NetR52_2: R52.2 ; port SAMPLE_TRIG

### Library data of the parts
J50-J56 = HRMG-300-467B-1: Description; Manufacturer_Name: Hirose; Manufacturer_Part_Number: HRM(G)-300-467B-1; Copyright: Copyright (C) 2026 Ultra Librarian. All rights reserved.; RefDes: RefDes; Type: Type
J57 = TSW-104-05-G-S: No Description Available; Manufacturer_Name: Samtec Inc; Copyright: Copyright (C) 2026 Ultra Librarian. All rights reserved.; Manufacturer_Part_Number: TSW-104-05-G-S; RefDes: RefDes; Type: Type
R50-R52 = CRCW04020000Z0ED: as R100 on sheet fmc; Manufacturer_Part_Number: CRCW04020000Z0ED
TP50-TP52 = 5011: TEST POINT; PIN DIA=0.125IN; TOTAL LENGTH=0.445IN; BOARD HOLE=0.063IN; BLACK; PHOSPHOR BRONZE WIRE SILVER PLATE FINISH;; Manufacturer_Name: Keystone Electronics; Copyright: Copyright (C) 2026 Ultra Librarian. All rights reserved.; Manufacturer_Part_Number: 5011; RefDes: RefDes; Type: Type

## Nets that join several sheets
+3V3: fmc (J1.C39 J2.D36 J2.D38 J2.D40), power (8 pins), eeprom (C30.1 R60.1 R61.1 U30.8), bias (C40.1 R40.1 U40.1 U41.8)
+VDDA1: power (J11.2), bobcat (R20.2)
+VDDA2: power (J12.2), bobcat (R21.1)
+VDDD: power (J10.2), bobcat (C20.1 C21.1 U20.12 U20.20)
+VDDIO: power (C16.1 U11.A1), bobcat (13 pins)
GND: fmc (J1.C34 J2.D35 J4.H2), power (14 pins), bobcat (21 pins), eeprom (6 pins), bias (5 pins), connectors (TP50.1 TP51.1 TP52.1)